# EAGLE design PCB (EAGLE 9.6.2)
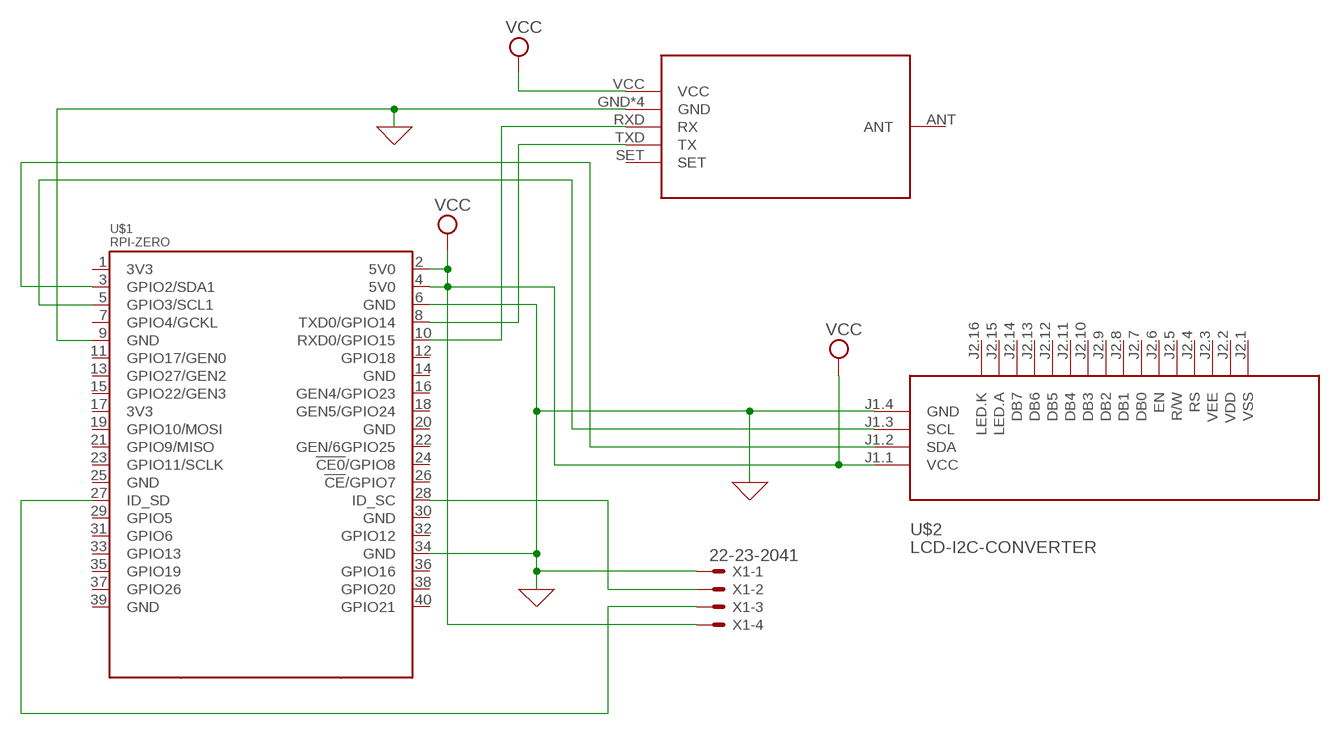
[diagram p0: schematic, sheet 1]

## Parts
U$1  RPI-ZERO  [RASPBERRYPI_BASTELSTUBE_V13_RASPI_BOARD_B+_FULL]
U$2  LCD-I2C-CONVERTER  [LCD-I2C-CONVERTER]
U$3  HC-12  [HC-12]
X1  22-23-2041  [22-23-2041]

## Nets
GND: U$1.6(GND) U$1.9(GND) U$1.34(GND) U$2.J1.4(GND) U$3.GND U$3.GND1(GND) U$3.GND2(GND) U$3.MCHFIX(GND) X1.1
N$1: U$1.3(GPIO2/SDA1) U$2.J1.2(SDA)
N$2: U$1.5(GPIO3/SCL1) U$2.J1.3(SCL)
N$3: U$1.8(TXD0/GPIO14) U$3.TXD(TX)
N$4: U$1.10(RXD0/GPIO15) U$3.RXD(RX)
N$5: U$1.28(ID_SC) X1.2
N$6: U$1.27(ID_SD) X1.3
VCC: U$1.2(5V0) U$1.4(5V0) U$2.J1.1(VCC) U$3.VCC X1.4
Unconnected: U$1.1(3V3) U$1.7(GPIO4/GCKL) U$1.11(GPIO17/GEN0) U$1.12(GPIO18) U$1.13(GPIO27/GEN2) U$1.14(GND) U$1.15(GPIO22/GEN3) U$1.16(GEN4/GPIO23) U$1.17(3V3) U$1.18(GEN5/GPIO24) U$1.19(GPIO10/MOSI) U$1.20(GND) U$1.21(GPIO9/MISO) U$1.22(GEN/6GPIO25) U$1.23(GPIO11/SCLK) U$1.24(!CE0!/GPIO8) U$1.25(GND) U$1.26(!CE!/GPIO7) U$1.29(GPIO5) U$1.30(GND) U$1.31(GPIO6) U$1.32(GPIO12) U$1.33(GPIO13) U$1.35(GPIO19) U$1.36(GPIO16) U$1.37(GPIO26) U$1.38(GPIO20) U$1.39(GND) U$1.40(GPIO21) U$2.J2.1(VSS) U$2.J2.2(VDD) U$2.J2.3(VEE) U$2.J2.4(RS) U$2.J2.5(R/W) U$2.J2.6(EN) U$2.J2.7(DB0) U$2.J2.8(DB1) U$2.J2.9(DB2) U$2.J2.10(DB3) U$2.J2.11(DB4) U$2.J2.12(DB5) U$2.J2.13(DB6) U$2.J2.14(DB7) U$2.J2.15(LED.A) U$2.J2.16(LED.K) U$3.ANT U$3.SET

## Library data of the parts
U$1 = RPI-Zero:RPI-ZERO
U$2 = diy-modules:LCD-I2C-CONVERTER: I2C Bus to 4-Bit Parallel LCD Interface with LED backlight driver
U$3 = hc12_433mhz:HC-12
X1 = con-molex:22-23-2041: .100" (2.54mm) Center Header - 4 Pin; MF: MOLEX; MPN: 22-23-2041; OC_FARNELL: 1462920; OC_NEWARK: 38C0355

## Board
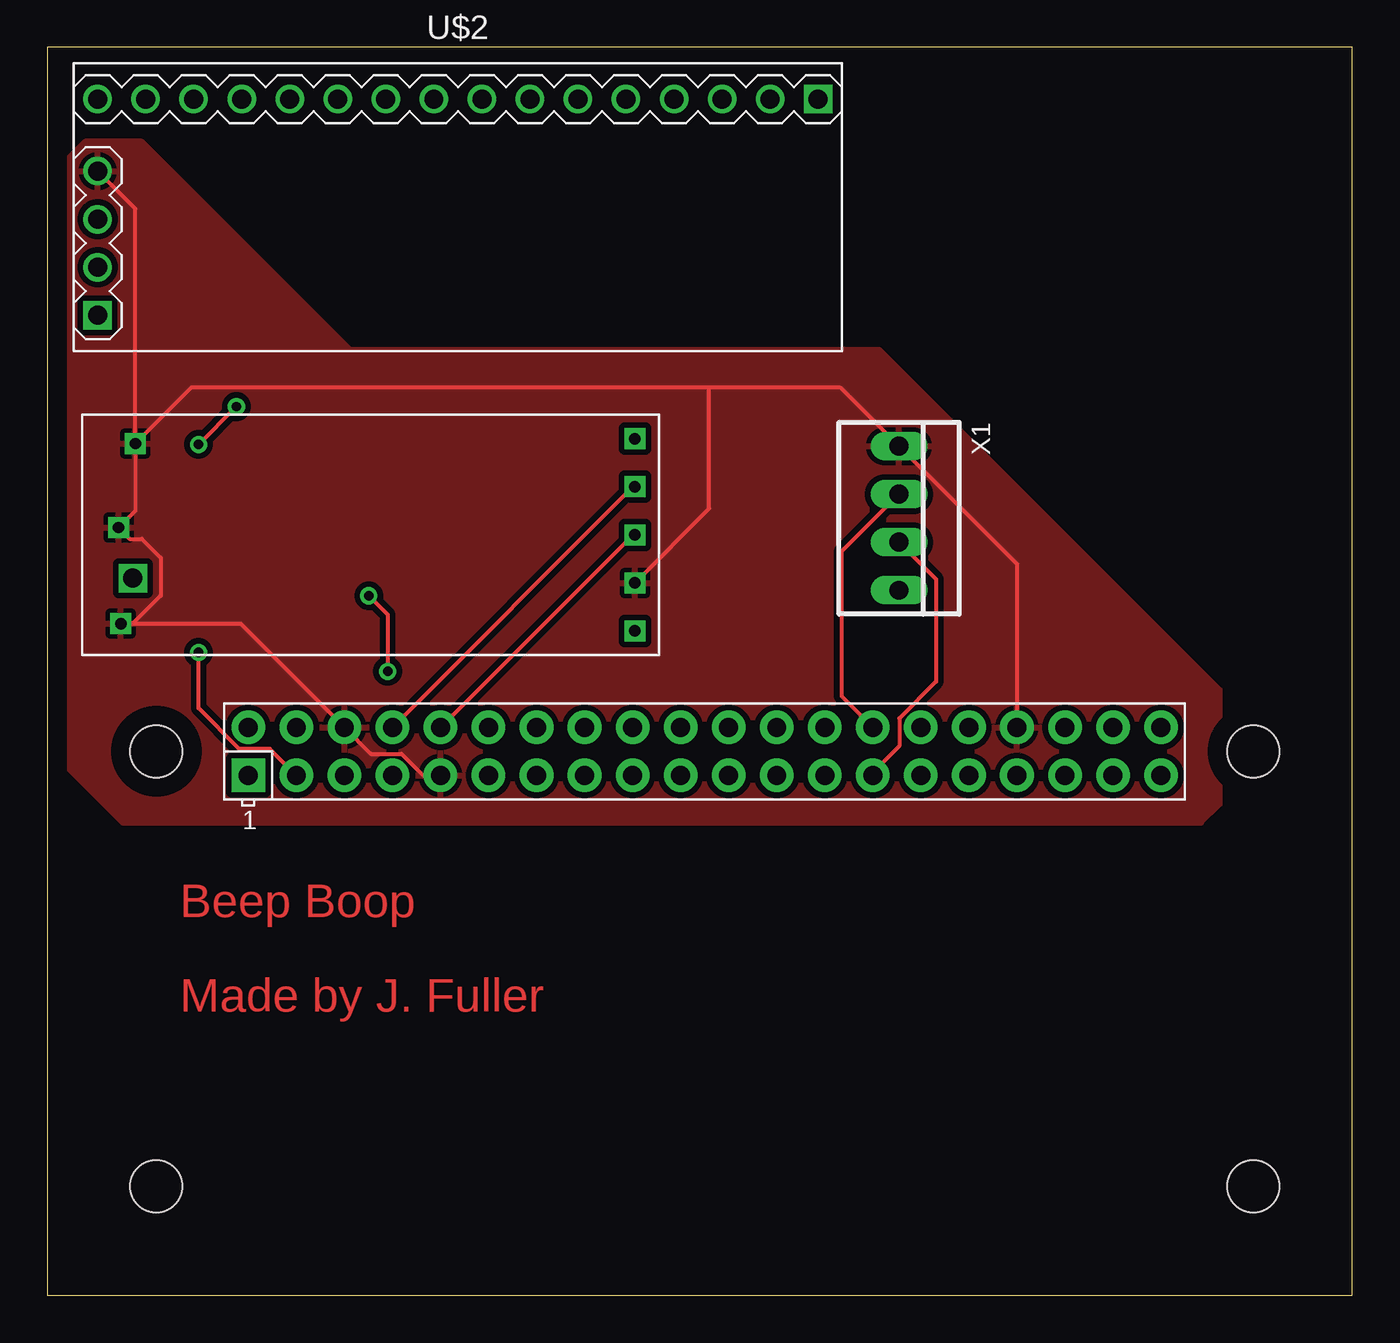
[diagram p1: board, top side]
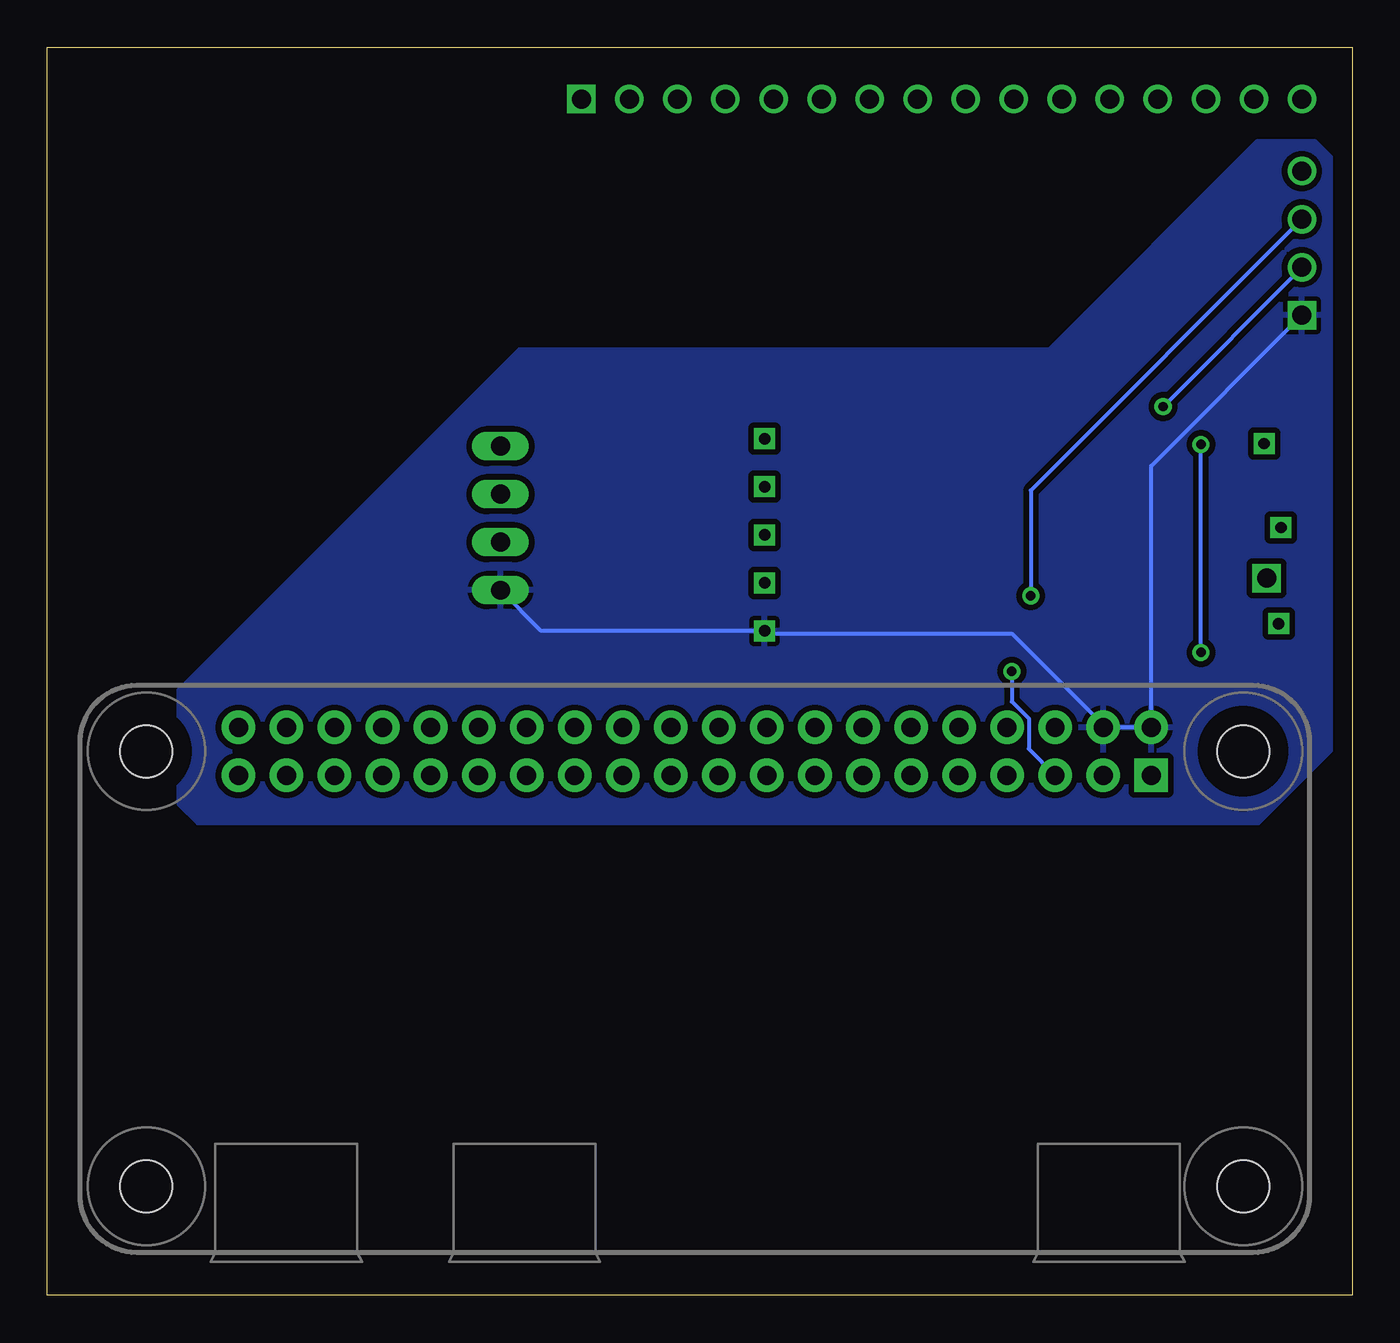
[diagram p2: board, bottom side, seen from below]

Size 69 x 66 mm. Coordinates in mm from the lower left corner, seen from the top.
Outline: 0,0 69,0 69,66 0,66 0,0
Copper layers (1*16): Top 0.035mm / dielectric 1.5mm / Bottom 0.035mm
Design rules "default": minimum track width 6mil, minimum drill 0.35mm, track to track 6mil, track to pad 6mil, pad to pad 6mil, via to via 6mil, smd to smd 6mil, copper to edge 40mil, drill to drill 6mil, minimum pad ring 10mil, minimum via ring 8mil, stop-mask expansion 4mil, vias tented up to drill 0mil, thermal gap 10mil

### Footprints (pad centres in the part's own frame; a part is rotated, then mirrored left to right if it is on the bottom)
RASPBERRYPI_BASTELSTUBE_V13_RASPI_BOARD_B+_FULL = drill 1 pad 1.778 square: 1 8.37,25.23 | drill 1 pad 1.778: 2 8.37,27.77; 3 10.91,25.23; 4 10.91,27.77; 5 13.45,25.23; 6 13.45,27.77; 7 15.99,25.23; 8 15.99,27.77; 9 18.53,25.23; 10 18.53,27.77; 11 21.07,25.23; 12 21.07,27.77; 13 23.61,25.23; 14 23.61,27.77; 15 26.15,25.23; 16 26.15,27.77; 17 28.69,25.23; 18 28.69,27.77; 19 31.23,25.23; 20 31.23,27.77; 21 33.77,25.23; 22 33.77,27.77; 23 36.31,25.23; 24 36.31,27.77; 25 38.85,25.23; 26 38.85,27.77; 27 41.39,25.23; 28 41.39,27.77; 29 43.93,25.23; 30 43.93,27.77; 31 46.47,25.23; 32 46.47,27.77; 33 49.01,25.23; 34 49.01,27.77; 35 51.55,25.23; 36 51.55,27.77; 37 54.09,25.23; 38 54.09,27.77; 39 56.63,25.23; 40 56.63,27.77 | hole 2.75: 3.5,3.5; 3.5,26.5; 61.5,3.5; 61.5,26.5
LCD-I2C-CONVERTER = drill 1 square: J1.1 -19.05,-5.08; J2.1 19.05,6.35 | drill 1: J1.2 -19.05,-2.54; J1.3 -19.05,0; J1.4 -19.05,2.54; J2.2 16.51,6.35; J2.3 13.97,6.35; J2.4 11.43,6.35; J2.5 8.89,6.35; J2.6 6.35,6.35; J2.7 3.81,6.35; J2.8 1.27,6.35; J2.9 -1.27,6.35; J2.10 -3.81,6.35; J2.11 -6.35,6.35; J2.12 -8.89,6.35; J2.13 -11.43,6.35; J2.14 -13.97,6.35; J2.15 -16.51,6.35; J2.16 -19.05,6.35
HC-12 = drill 1 square: ANT 25.273,7.366 | drill 0.6 square: GND -1.27,7.62; GND1 25.908,9.779; GND2 26.035,4.699; MCHFIX 25.146,0.254; RXD -1.27,5.08; SET -1.27,0; TXD -1.27,2.54; VCC -1.27,10.16
22-23-2041 = drill 1 long: 1 -3.81,0; 2 -1.27,0; 3 1.27,0; 4 3.81,0

### Placement (x,y rotation side)
U$1  2.26,2.27 0 top
U$2  21.71,56.91 0 top
U$3  29.8,45.3 180 top
X1  45.04,41.1 270 top

### Tracks (layer width: path | path; a pad name or v marks a point on that pad's centre or on a via)
GND
  Top 0.2: U$3.MCHFIX 7.61,48 35,48 | 35,48 41.95,48 X1.1 51.27,38.68 U$1.34 | U$3.MCHFIX 4.65,41.49 U$3.GND2 4.37,40 5,40 6,39 6,37 4.52,35.52 U$3.GND1 10.23,35.52 U$1.6 17.11,28.64 18.72,28.64 19.86,27.5 U$1.9 | U$3.GND 35,41.61 35,48 | U$3.MCHFIX 4.65,57.46 U$2.J1.4
  pour Top (isolate 0.305): 61,25 62,26 62,32 44,50 16,50 5,61 2,61 1,60 1,28 4,25
N$1  (via drill 0.5)
  Top 0.2: U$1.3 11.77,28.9 10.16,28.9 8,31.06 v8,34 | v8,45 v10,47
  Bottom 0.2: v8,34 v8,45 | v10,47 2.66,54.34 U$2.J1.2
N$2  (via drill 0.5)
  Top 0.2: v17,37 18,36 v18,33
  Bottom 0.2: U$2.J1.3 17,42.57 v17,37 | v18,33 18,31.4 17.11,30.51 17.11,28.9 U$1.5
N$3
  Top 0.2: U$1.8 30.97,42.76 U$3.TXD
N$4
  Top 0.2: U$1.10 30.97,40.22 U$3.RXD
N$5
  Top 0.2: X1.2 42,39.33 42,31.69 U$1.28
N$6
  Top 0.2: X1.3 47,37.87 47,32.46 45.05,30.51 45.05,29.05 43.65,27.65 U$1.27
VCC
  Bottom 0.2: X1.4 42.89,35.14 U$3.VCC 30.93,35 18,35 13.17,30.17 U$1.4 U$1.2 10.63,43.86 U$2.J1.1
  pour Bottom (isolate 0.305): 5,61 2,61 1,60 1,29 5,25 61,25 62,26 62,32 44,50 19,50 16,50

### Text on the board
Top: Beep Boop | Made by J. Fuller